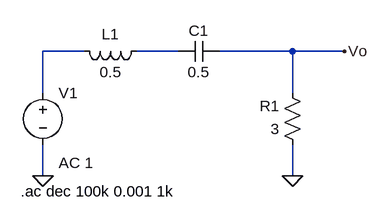
[diagram p0: schematic Ej3.asc]
Ej3.asc, the LTspice schematic file:
Version 4
SHEET 1 880 680
WIRE 48 112 -16 112
WIRE 192 112 128 112
WIRE 368 112 256 112
WIRE 448 112 368 112
WIRE -16 176 -16 112
WIRE 368 176 368 112
WIRE -16 304 -16 256
WIRE 368 304 368 256
FLAG 368 304 0
FLAG -16 304 0
FLAG 448 112 Vo
SYMBOL voltage -16 160 R0
WINDOW 123 24 124 Left 2
WINDOW 39 0 0 Left 0
SYMATTR InstName V1
SYMATTR Value ""
SYMATTR Value2 AC 1
SYMBOL res 384 272 R180
WINDOW 0 36 76 Left 2
WINDOW 3 36 40 Left 2
SYMATTR InstName R1
SYMATTR Value 3
SYMBOL ind 144 96 R90
WINDOW 0 5 56 VBottom 2
WINDOW 3 32 56 VTop 2
SYMATTR InstName L1
SYMATTR Value 0.5
SYMBOL cap 256 96 R90
WINDOW 0 0 32 VBottom 2
WINDOW 3 32 32 VTop 2
SYMATTR InstName C1
SYMATTR Value 0.5
TEXT -50 328 Left 2 !.ac dec 100k 0.001 1k

The netlist it stands for:
* Ej3.asc
V1 N001 0 AC 1
R1 0 Vo 3
L1 N002 N001 0.5
C1 Vo N002 0.5
.ac dec 100k 0.001 1k
.backanno
.end